# Altium schematic sheet LT4363-2 SEL Protection.SchDoc: LT4363-2 SEL Protection
size Letter; SheetNumber: 13; SheetTotal: 18
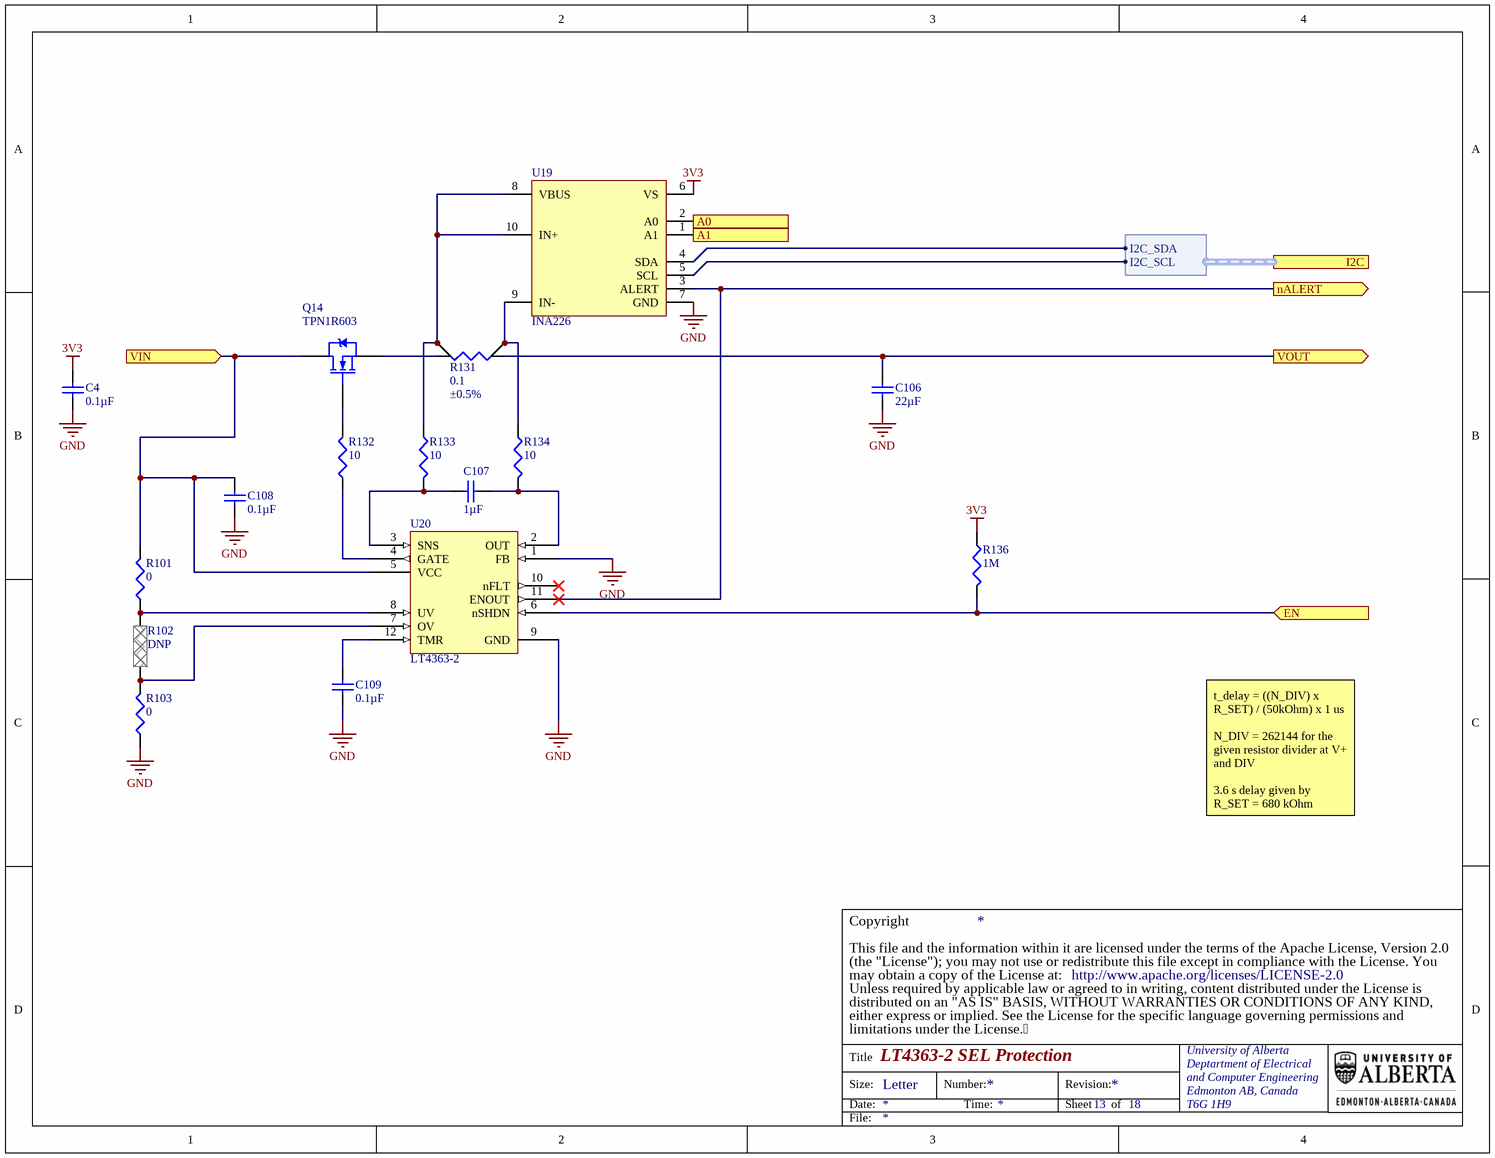
[diagram p0: LT4363-2 SEL Protection.SchDoc]

## Parts
C4  value 0.1µF  [TDK-CGA2B]  (hidden comment: Cap)
C106  value 22µF  [TY-1206L]  (hidden comment: Cap)
C107  value 1µF  [TY-0402D]  (hidden comment: Cap)
C108  value 0.1µF  [TDK-CGA2B]  (hidden comment: Cap)
C109  value 0.1µF  [TDK-CGA2B]  (hidden comment: Cap)
Q14  TPN1R603  [TOSH-S-3X1S]
R101  value 0  [PANA-ERJ2G]  (hidden comment: Jumper)
R102  DNP  [PANA-ERJ2G]  (no BOM)
R103  value 0  [PANA-ERJ2G]  (hidden comment: Jumper)
R131  value 0.1  Tolerance: ±0.5%  [VSH-WSL0805]  (hidden comment: Res Sense)
R132  value 10  [PANA-ERA2A]  (hidden comment: Res3)
R133  value 10  [PANA-ERA2A]  (hidden comment: Res3)
R134  value 10  [PANA-ERA2A]  (hidden comment: Res3)
R136  value 1M  [PANA-ERJ2R]  (hidden comment: Res3)
U19  INA226  [TI-DGS]
U20  LT4363-2  [LT-MS12]

## Ports
A0 (in), A1 (in), EN (in), I2C (harness INA226_I2C), nALERT (out), VIN (in), VOUT (out)

## Harnesses
INA226_I2C: I2C_SCL, I2C_SDA

## Nets
3V3: C4.2 R136.2 U19.6(VS)
GND: C4.1 C106.1 C108.1 C109.1 R103.1 U19.7(GND) U20.1(FB) U20.9(GND)
A0: U19.2(A0) ; port A0
A1: U19.1(A1) ; port A1
EN: R136.1 U20.6(nSHDN) ; port EN
nALERT: U19.3(ALERT) U20.11(ENOUT) ; port nALERT
VIN: C108.2 Q14.2(D) R101.2 U20.5(VCC) ; port VIN
VOUT: C106.2 R131.2(I2) ; port VOUT
NetC107_1: C107.1 R133.2 U20.3(SNS)
NetC107_2: C107.2 R134.2 U20.2(OUT)
NetC109_2: C109.2 U20.12(TMR)
NetQ14_1: Q14.1(G) R132.2
NetQ14_3: Q14.3(S) R131.1(I1)
NetR101_1: R101.1 R102.2 U20.8(UV)
NetR102_1: R102.1 R103.2 U20.7(OV)
NetR131_3: R131.3(S2) R134.1 U19.9(IN-)
NetR131_4: R131.4(S1) R133.1 U19.8(VBUS) U19.10(IN+)
NetR132_1: R132.1 U20.4(GATE)
NetU19_4: U19.4(SDA) ; port I2C.I2C_SDA
NetU19_5: U19.5(SCL) ; port I2C.I2C_SCL

Not connected (* = marked no-connect by the designer): U20 10(nFLT)*

## Notes on the sheet
- t_delay = ((N_DIV) x R_SET) / (50kOhm) x 1 us
  N_DIV = 262144 for the given resistor divider at V+ and DIV
  3.6 s delay given by R_SET = 680 kOhm
- (the "License"); you may not use or redistribute this file except in compliance with the License. You
- This file and the information within it are licensed under the terms of the Apache License, Version 2.0
- Copyright
- Unless required by applicable law or agreed to in writing, content distributed under the License is
- distributed on an "AS IS" BASIS, WITHOUT WARRANTIES OR CONDITIONS OF ANY KIND,
- either express or implied. See the License for the specific language governing permissions and
- limitations under the License.
- may obtain a copy of the License at:
- http://www.apache.org/licenses/LICENSE-2.0
- Title
- Size:
- Date:
- Letter
- Number:
- Time:
- Revision:
- Sheet
- of
- University of Alberta
- Deptartment of Electrical
- and Computer Engineering
- Edmonton AB, Canada
- T6G 1H9
- File:

## Library data of the parts
C4 C108 C109 = PC-TDK-02259: CAP CER 0.1UF 50V X7R 0402; Manufacturer Part Number: CGA2B3X7R1H104K050BB; Index: 2259; Designator: C?; Tolerance: ±10%; Published: 2016-03-16; LatestRevisionDate: 2016-03-16; LatestRevisionNote: ...; PackageReference: 0402 (1005 Metric); Publisher: AlbertaSat; PackageDescription: Radial Cap, Thru-Hole; 2 Leads; 0.3 in Pin Spacing; Part Number: PC-TDK-02259; Supplier Part Number 1: 445-6899-1-ND; Supplier 1: Digi-key; Supplier Link: http://www.digikey.ca/product-search/en?keywords=445-6899-1-ND; Voltage - Rated: 50V; Temperature Coefficient: X7R; Applications: Automotive
C106 = PC-TY-00721: CAP CER 22UF 16V X7R 1206; Manufacturer Part Number: EMK316BB7226ML-T; Index: 721; Designator: C?; Tolerance: ±20%; Published: 3/13/2016; LatestRevisionDate: 3/13/2016; LatestRevisionNote: ...; PackageReference: 1206 (3216 Metric); Publisher: AlbertaSat; PackageDescription: Chip Capacitor, 2-Leads, Body 3.20x1.60mm, IPC Low Density; Part Number: PC-TY-00721; Supplier Part Number 1: 587-4319-1-ND; Supplier 1: Digi-key; Supplier Link: http://www.digikey.ca/product-search/en?keywords=587-4319-1-ND; Voltage-Rated: 16V; Temperature Coefficient: X7R; Application: General Purpose
C107 = PC-TY-00806: CAP CER 1UF 25V X5R 0402; Manufacturer Part Number: GRT155R61E105KE01D; Index: 806; Designator: C?; Tolerance: ±10%; Published: 2019-07-31; LatestRevisionDate: 2019-07-31; LatestRevisionNote: ...; PackageReference: 0402 (1005 Metric); Publisher: AlbertaSat; PackageDescription: Chip Capacitor, 2-Leads, Body 1.00x0.50mm, IPC Low Density; Part Number: PC-TY-00806; Supplier Part Number 1: 490-12263-1-ND; Supplier 1: Digi-key; Supplier Part Number 2: 81-GRT155R61E105KE1D; Supplier 2: Mouser; Supplier Link: #https://www.digikey.ca/products/en?keywords=490-12263-1-ND#; Voltage-Rated: 25V; Temperature Coefficient: X5R; Application: Automotive
Q14 = PU-TOSH-00002: X35 PB-F POWER MOSFET TRANSISTOR; Index: 2; Designator: Q?; Rds On: 1.6mOhm @ 40A, 10V; Part Number: PU-TOSH-00002; Manufacturer Part Number: TPN1R603PL,L1Q; Supplier Part Number 1: TPN1R603PLL1QCT-ND; Supplier 1: Digi-key; Supplier Part Number 2: 757-TPN1R603PLL1Q; Supplier 2: Mouser; Publisher: AlbertaSat; Published: 2020-04-01; LatestRevisionDate: 2020-04-01; LatestRevisionNote: ...; PackageReference: 8-TSON Advance (3.3x3.3); PackageDescription: SON, 8-Leads, Body 3.10x3.10mm, Pitch 0.65mm, Thermal Pad 2.49x2.06mm, IPC Low Density; Supplier Link: #https://www.digikey.ca/product-detail/en/toshiba-semiconductor-and-storage/TPN1R603PL-L1Q/TPN1R603PLL1QCT-ND/6570930#
R101 R103 = 13127: RES SMD 0.0OHM JUMPER 1/10W 0402; Part Number: 13127; Manufacturer Part Number: ERJ-2GE0R00X; Designator: R?; Power: 0.1W, 1/10W; PackageDescription: Chip Resistor, 2-Leads, Body 1.00x0.50mm, IPC Low Density; Supplier Part Number 1: P0.0JCT-ND; Supplier 1: Digi-Key; Supplier Link: http://www.digikey.ca/product-search/en?keywords=P0.0JCT-ND; PackageReference: 0402 (1005 Metric); Tolerance: Jumper; Temperature Coefficient: -; Type: Jumper
R102 = 19766: Part Number: 19766; Designator: R?; Value: DNP; PackageReference: 0402 (1005 Metric); PackageDescription: Chip Resistor, 2-Leads, Body 1.00x0.50mm, IPC Low Density
R131 = PR-VSH-00315: RES 0.1 OHM 0.5% 1/4W 0805; Manufacturer Part Number: WSL0805R1000DEA18-ND; Power - Rated: 0.25W, 1/4W; Index: 315; Designator: R?; Temperature Coefficient: ±75ppm/°C; Part Number: PR-VSH-00315; Supplier Part Number 1: WSL0805R1000DEA18-ND; Supplier 1: Digi-key; Publisher: AlbertaSat; Published: 2019-08-08; LatestRevisionDate: 2019-08-08; LatestRevisionNote: ...; PackageReference: 0805 (2012 Metric); PackageDescription: 0805 (2012 Metric); Supplier Link: #https://www.digikey.ca/products/en?keywords=WSL0805R1000DEA18-ND#
R132-R134 = 13235: RES SMD 10 OHM 0.5% 1/16W 0402; Part Number: 13235; Manufacturer Part Number: ERA-2AKD100X; Designator: R?; Power: 0.063W, 1/16W; Temperature Coefficient: ±100ppm/°C; Published: 8-Jun-2000; LatestRevisionDate: 29-May-2009; LatestRevisionNote: IPC-7351 Footprint Added.; PackageReference: 0402 (1005 Metric); Publisher: Altium Limited; PackageDescription: Chip Resistor, 2-Leads, Body 1.00x0.50mm, IPC Low Density; Supplier Part Number 1: P10DDCT-ND; Supplier 1: Digi-Key; Supplier Link: http://www.digikey.ca/product-search/en?keywords=P10DDCT-ND; Tolerance: ±0.5%
R136 = 19704: RES SMD 1M OHM 1% 1/10W 0402; Part Number: 19704; Manufacturer Part Number: ERJ-2RKF1004X; Designator: R?; Power: 0.1W, 1/10W; Temperature Coefficient: ±100ppm/°C; Published: 8-Jun-2000; LatestRevisionDate: 29-May-2009; LatestRevisionNote: IPC-7351 Footprint Added.; PackageReference: 0402 (1005 Metric); Publisher: Altium Limited; PackageDescription: Chip Resistor, 2-Leads, Body 1.00x0.50mm, IPC Low Density; Supplier Part Number 1: P1.00MLCT-ND; Supplier 1: Digi-Key; Supplier Link: http://www.digikey.ca/product-search/en?keywords=P1.00MLCT-ND; Tolerance: ±1%
U19 = 19: IC MONITOR PWR/CURR BIDIR 10MSOP; Part Number: 19; Manufacturer Part Number: INA226AQDGSRQ1; Designator: U?; Supplier Part Number 2: 595-INA226AQDGSRQ1; Supplier 2: Mouser; Supplier Part Number 1: 296-42503-1-ND; Supplier 1: Digi-Key; Supplier Link: https://www.digikey.com/product-detail/en/texas-instruments/INA226AQDGSRQ1/296-42503-1-ND/5416001; PackageReference: TI-MSOP10
U20 = PU-LTC-00046: IC SURGE STOPPER HV 12MSOP; Manufacturer Part Number: LT4363MPMS-2#PBF; Index: 46; Part Number: PU-LTC-00046; Supplier Part Number 1: LT4363MPMS-2#PBF-ND; Supplier 1: Digi-key; Supplier Part Number 2: 584-LT4363MPMS-2#PBF; Supplier 2: Mouser; Publisher: AlbertaSat; Published: 2018-07-18; LatestRevisionDate: 2018-07-18; LatestRevisionNote: ...; PackageReference: 12-TSSOP (0.118", 3.00mm Width); Supplier Link: https://www.digikey.ca/product-detail/en/linear-technology-analog-devices/LT4363MPMS-2-PBF/LT4363MPMS-2-PBF-ND/4271836